# EAGLE design chirp-ble (EAGLE 6.6.0)
Plant watering alarm v2.4

## Sheet 1 of 2: Plant watering alarm v2.4
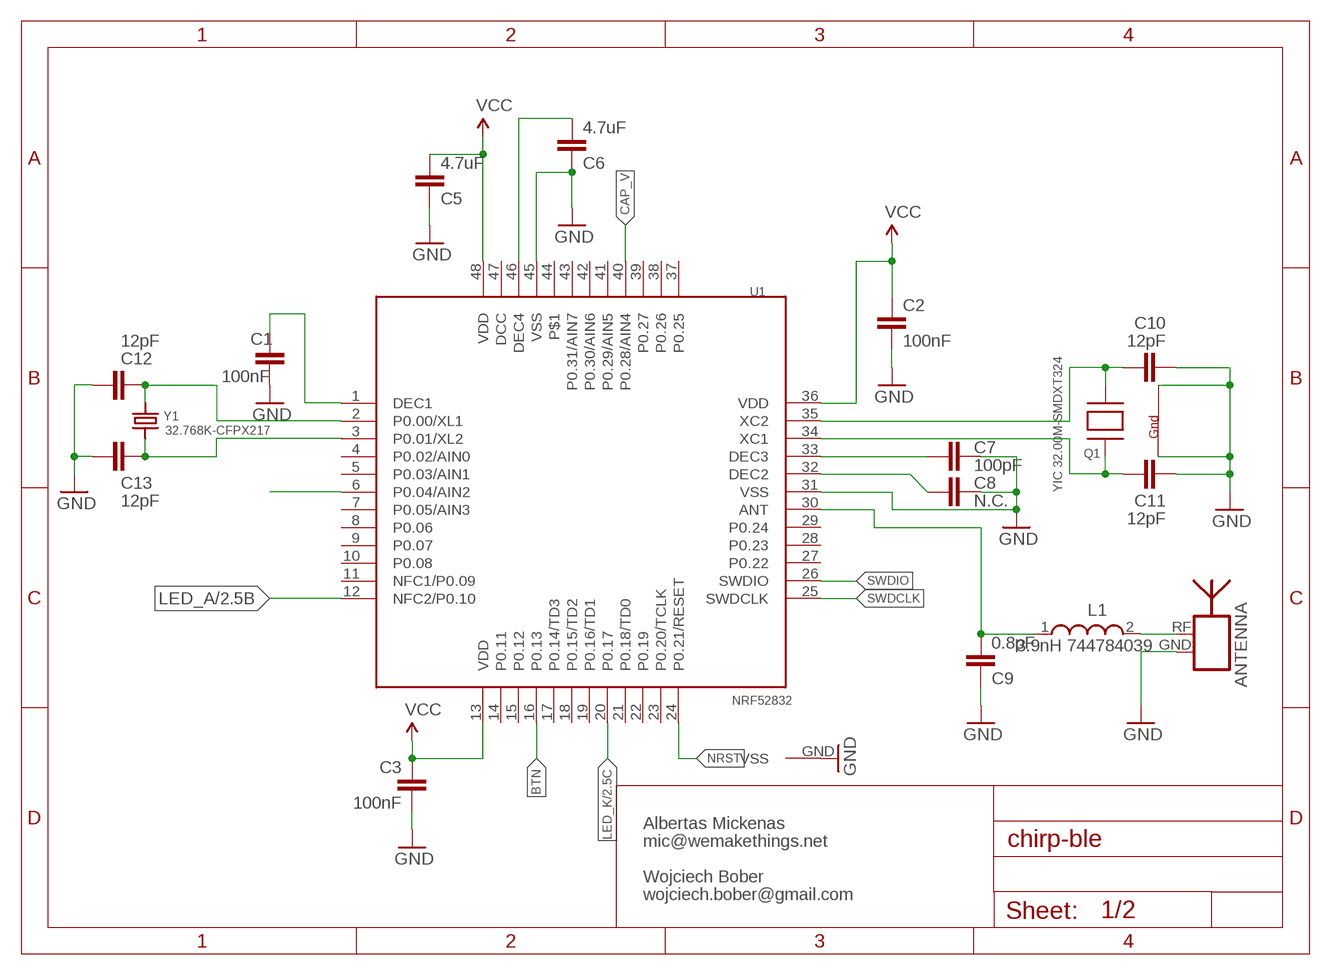
[diagram p0: schematic, sheet 1]

### Parts
ANTENNA  ANTENNA_1RIGHT  [SWRA117D_RIGHT]
C1  100nF  C-EUC0402  [C0402]
C2  100nF  C-EUC0402  [C0402]
C3  100nF  C-EUC0402  [C0402]
C5  4.7uF  C-EUC0402  [C0402]
C6  4.7uF  C-EUC0402  [C0402]
C7  100pF  C-EUC0402  [C0402]
C8  N.C.  C-EUC0402  [C0402]
C9  0.8pF  C-EUC0402  [C0402]
C10  12pF  C-EUC0402  [C0402]
C11  12pF  C-EUC0402  [C0402]
C12  12pF  C-EUC0402  [C0402]
C13  12pF  C-EUC0402  [C0402]
L1  3.9nH 744784039  WE-MK_0402  [WE-MK_0402]
Q1  YIC 32.00M-SMDXT324  XTAL-4-3225  [NX3225]
U1  NRF52832  [QFN48]
Y1  32.768K-CFPX217  CRYSTAL.ABS07  [ABS07]

### Nets
ANT: C9.2 L1.1 U1.30(ANT)
BTN: U1.16(P0.13) ; also sheet 2
CAP_V: U1.40(P0.28/AIN4) ; also sheet 2
CLK_OUT: U1.6(P0.04/AIN2) ; also sheet 2
GND: ANTENNA.GND C1.2 C2.2 C3.2 C5.1 C6.1 C7.2 C8.2 C9.1 C10.2 C11.2 C12.2 C13.1 Q1.2(G2) Q1.4(G1) U1.31(VSS) U1.45(VSS) U1.GND(VSS) ; also sheet 2
LED_A: U1.12(NFC2/P0.10) ; also sheet 2
LED_K: U1.20(P0.17) ; also sheet 2
N$1: C8.1 U1.32(DEC2)
N$2: C10.1 Q1.3(X2) U1.35(XC2)
N$4: ANTENNA.RF L1.2
N$7: C11.1 Q1.1(X1) U1.34(XC1)
N$10: C1.1 U1.1(DEC1)
N$11: C6.2 U1.46(DEC4)
N$12: C7.1 U1.33(DEC3)
NRST: U1.24(P0.21/RESET) ; also sheet 2
SWDCLK: U1.25(SWDCLK) ; also sheet 2
SWDIO: U1.26(SWDIO) ; also sheet 2
VCC: C2.1 C3.1 C5.2 U1.13(VDD) U1.36(VDD) U1.48(VDD) ; also sheet 2
Y1_M: C13.2 U1.3(P0.01/XL2) Y1.1
Y1_P: C12.1 U1.2(P0.00/XL1) Y1.2
Unconnected: U1.4(P0.02/AIN0) U1.5(P0.03/AIN1) U1.7(P0.05/AIN3) U1.8(P0.06) U1.9(P0.07) U1.10(P0.08) U1.11(NFC1/P0.09) U1.14(P0.11) U1.15(P0.12) U1.17(P0.14/TD3) U1.18(P0.15/TD2) U1.19(P0.16/TD1) U1.21(P0.18/TD0) U1.22(P0.19) U1.23(P0.20/TCLK) U1.27(P0.22) U1.28(P0.23) U1.29(P0.24) U1.37(P0.25) U1.38(P0.26) U1.39(P0.27) U1.41(P0.29/AIN5) U1.42(P0.30/AIN6) U1.43(P0.31/AIN7)

### Notes on the sheet
- Albertas Mickenas
- mic@wemakethings.net
- Wojciech Bober
- wojciech.bober@gmail.com

## Sheet 2 of 2
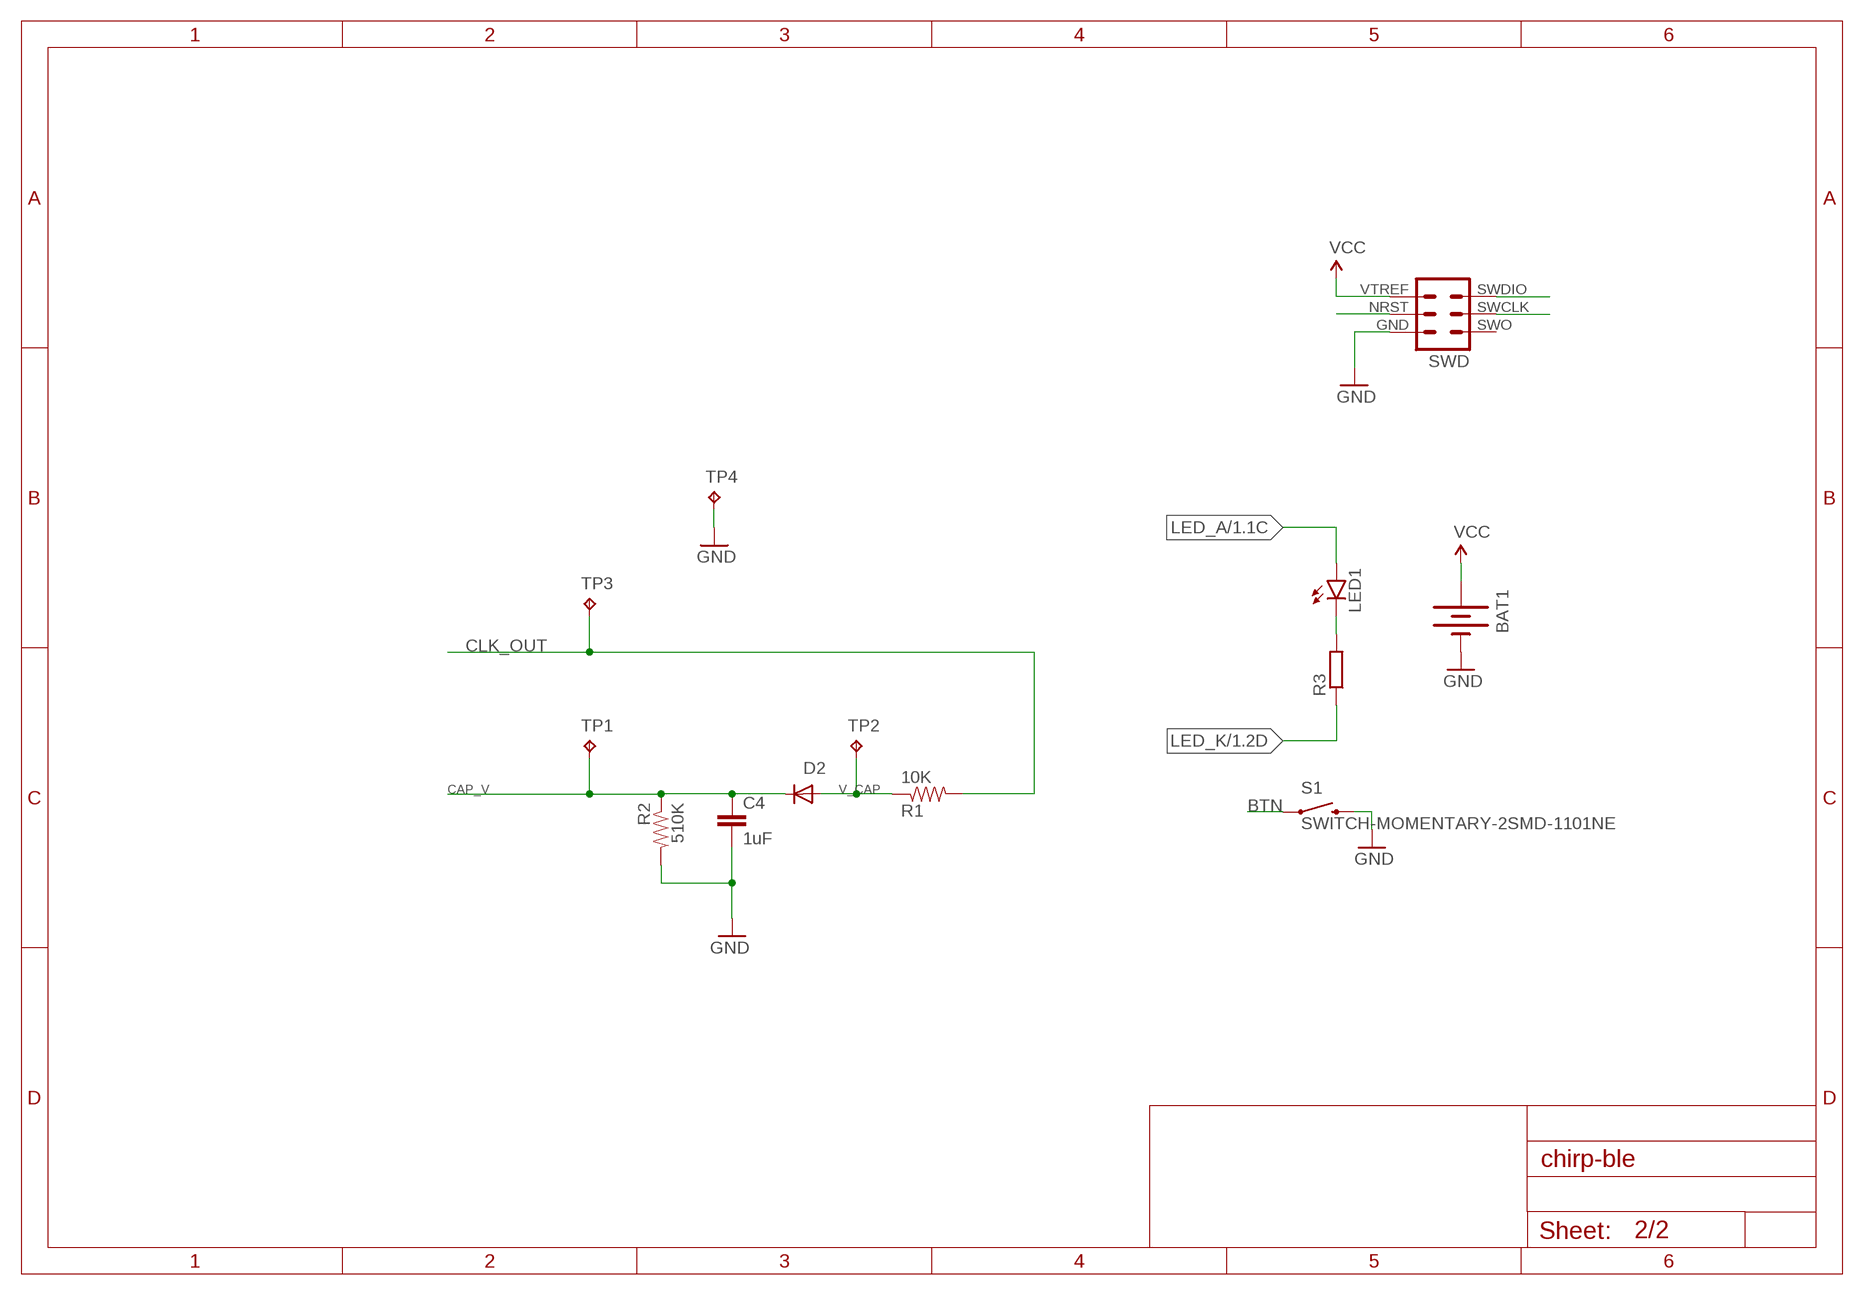
[diagram p1: schematic, sheet 2]

### Parts
BAT1  BATTERY12MM  [BATTCON_12MM]
C4  1uF  CAP0603-CAP  [0603-CAP]
D2  DIODE-SCHOTTKY_  DIODESOD-523  [SOD-523]
LED1  LED0603  [LED-0603]
R1  10K  RESISTOR0603-RES  [0603-RES]
R2  510K  RESISTOR0603-RES  [0603-RES]
R3  R-EU_R0402  [R0402]
S1  SWITCH-MOMENTARY-2SMD-1101NE  [TACTILE-SWITCH-1101NE]
SWD  SWD  [MA03-2]
TP1  TPB1,27  [B1,27]
TP2  TPB1,27  [B1,27]
TP3  TPB1,27  [B1,27]
TP4  TPB1,27  [B1,27]

### Nets
BTN: S1.1 ; also sheet 1
CAP_V: C4.1 D2.K(C) R2.1 TP1.TP ; also sheet 1
CLK_OUT: R1.2 TP3.TP ; also sheet 1
GND: BAT1.GND(-) C4.2 R2.2 S1.2 SWD.GND TP4.TP ; also sheet 1
LED_A: LED1.A ; also sheet 1
LED_K: R3.1 ; also sheet 1
N$6: LED1.C R3.2
NRST: SWD.NRST(NRESET) ; also sheet 1
SWDCLK: SWD.SWCLK ; also sheet 1
SWDIO: SWD.SWDIO ; also sheet 1
V_CAP: D2.A R1.1 TP2.TP
VCC: BAT1.PWR@1(+) BAT1.PWR@2(+) SWD.VTREF ; also sheet 1
Unconnected: SWD.SWO

## Power pins joined to a net without a drawn wire
DCC: U1.47(DCC)
P$1: U1.44

## Library data of the parts
ANTENNA = ant-planar-1:ANTENNA_1
BAT1 = SparkFun-Electromechanical:BATTERY: Battery Holders Various common sizes : AA, AAA, 18650 (PRT-12895), 20mm coin cell and 12mm coin cell. 20MM_4LEGS, BATT-10373; PROD_ID: BATT-08044
C1-C3 C5-C13 = rcl:C-EU: CAPACITOR, European symbol
C4 = SparkFun:CAP: Capacitor Standard 0603 ceramic capacitor, and 0.1" leaded capacitor.
D2 = microbuilder:DIODE: Diode SMADIODE - SMA Surface Mount Package 20V 1A Schottky Diode Digikey (500mV @ 1A, 500uA Vr @ 20V): 641-1014-6-ND 10V 2A Schottky Diode Digikey (350mV @ 2A, 700uA Vr @ 10V): MBRA210LT3 SOD-123 30V 200mA (800mV Vf, 2uA Vr @ 25V) Schottky Diode (very fast switching for boost, etc.) - Digikey: BAT54T1GOSTR-ND 30V 500mA (430mV Vf, 130uA Vr @ 30V) Schottky Diode - Digikey: B0530W-FDICT-ND MBR120 1A 20V (0.34Vf) Schottky Diode - Digikey: MBR120VLSFT1GOSCT-ND SOD-323 10V 570mA (380mV Vf, 3ns) Schottky Diode - Digikey: ZLLS410CT-ND 1N4148WS - 75V 150mA (1V Vf @ 10mA, 4ns) Simple Diode - Digikey: 1N4148WSFSCT-ND, Mouser: 512-1N4148WS SOD-523 BAT54 30V 200mA Schottky (0.8 Vf @ 100mA, 5ns) - Digikey: BAT54XV2CT-ND 30V 30mA Schottky Diode (RB751S-40TE61) - Digikey: RB751S-40TE61CT-ND SOT23-R/W - SOT23 Package (R = Solder Paste/Reflow Ovens, W = Hand-Soldering) BAT54Film 40V 300mA - Digikey: 497-7162-1-ND DO-1N4148 Through Hole Small Current Diode (any model)
L1 = SignalCommunications:WE-MK: Multilayer Ceramic SMD Inductor Characteristics Windings printed on ceramic substrate Extremely high self resonant frequency > 17 GHz Inductive tolerances of 5%; ± 0.3 nH Operating temperature: –40°C to +120°C Inductance is stable over temperature Applications High frequency circuits Bluetooth Wireless LAN Filter circuits Oscillators Pagers Laptops PCMCIA-cards <http://katalog.we-online.de/media/images/eisos/RfMK_pf2.jpg> Details see: http://katalog.we-online.de/en/pbs/WE-MK? Updated by Dan Xu 2014-07-08 2014 (C) Wurth Elektronik
LED1 = SparkFun-LED:LED: LEDs Standard schematic elements and footprints for 5mm, 3mm, 1206, and 0603 sized LEDs. 5mm - Spark Fun Electronics SKU : COM-00529 (and others)
Q1 = adafruit:XTAL-4: Classic 4-pin 3.2 x 2.5mm crystal
R1 R2 = SparkFun:RESISTOR: Resistor Basic schematic elements and footprints for 0603, 1206, and PTH resistors.
R3 = rcl:R-EU_: RESISTOR, European symbol
S1 = SparkFun-Electromechanical:SWITCH-MOMENTARY-2: Various NO switches- pushbuttons, reed, etc; PROD_ID: SWCH-00815
SWD = WB:SWD: PIN HEADER; OC_FARNELL: unknown; OC_NEWARK: unknown
TP1-TP4 = testpad:TP: Test pad
U1 = NordicSemi:NRF52832: Bluetooth 4.0 Low Energy/2.4Ghz NORDIC SEMICONDUCTOR
Y1 = abracon:CRYSTAL

## Net classes
0 Default: width 0.2 mm

## Board
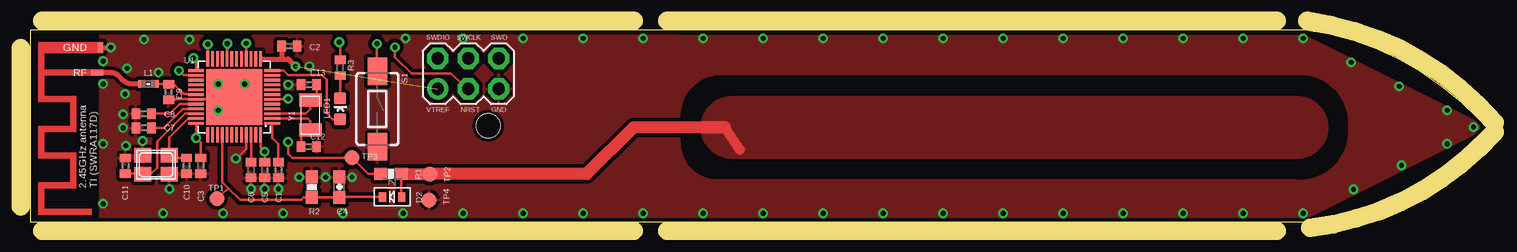
[diagram p2: board, top side]
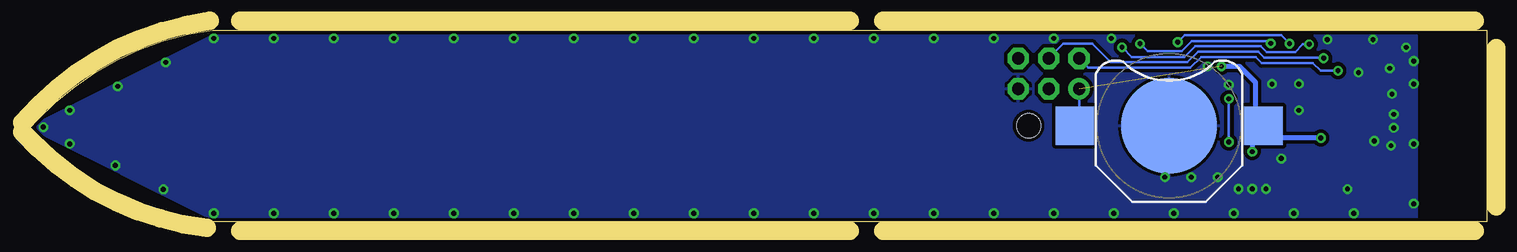
[diagram p3: board, bottom side, seen from below]

Size 121.41 x 16 mm. Coordinates in mm from the lower left corner, seen from the top.
Outline: 0,0 106.17,0 arc39 120.78,7.24 121.41,7.87 120.78,8.51 arc39 106.17,16 0,16 0,0
Copper layers (1*16): Top 0.035mm / dielectric 1mm / Bottom 0.035mm
Design rules "Fusion_eagle_rule_v1.1 *": minimum track width 0.2mm, minimum drill 0.4mm, track to track 0.2mm, track to pad 0.2mm, pad to pad 0.05mm, via to via 0.2mm, smd to smd 0mil, copper to edge 10mil, drill to drill 10mil, minimum pad ring 10mil, minimum via ring 6mil, stop-mask expansion 2mil, vias tented up to drill 0.3mm, thermal gap 10mil
Holes 2 mm at 38.19,8
tRestrict: area 9.5,9.5 to 10.9,10.9
Milling: 8 lines

### Footprints (pad centres in the part's own frame; a part is rotated, then mirrored left to right if it is on the bottom)
SWRA117D_RIGHT = smd 0.813 x 0.406: GND -0.45,0.25 | smd 0.508 x 1.016: RF -2.55,0.5
BATTCON_12MM = smd 8 x 8: GND 0,0 | smd 3.175 x 3.175: PWR@1 -7.874,0; PWR@2 7.874,0
C0402 = smd 0.7 x 0.9: 1 -0.65,0; 2 0.65,0
0603-CAP = smd 1.1 x 1: 1 -0.85,0; 2 0.85,0
SOD-523 = smd 0.8 x 0.6: A 0,-0.8; K 0,0.8
WE-MK_0402 = smd 0.6 x 0.6: 1 -0.55,0; 2 0.55,0
LED-0603 = smd 1 x 1: A 0,-0.877; C 0,0.877
NX3225 = smd 1.4 x 1.2: 1 -1.1,-0.8; 2 1.1,-0.8; 3 1.1,0.8; 4 -1.1,0.8
0603-RES = smd 1.1 x 1: 1 -0.85,0; 2 0.85,0
R0402 = smd 0.7 x 0.9: 1 -0.65,0; 2 0.65,0
TACTILE-SWITCH-1101NE = smd 2.3 x 1.6: 1 -3.15,0; 2 3.15,0
MA03-2 = drill 1.016 pad 1.778 octagon: GND 2.54,-1.27; NRST 0,-1.27; SWCLK 0,1.27; SWDIO -2.54,1.27; SWO 2.54,1.27 | drill 1.016 pad 1.778: VTREF -2.54,-1.27
B1,27 = smd 1.27 x 1.27: TP 0,0
QFN48 = smd 1.3 x 0.226: 1 -3.17,2.2; 2 -3.17,1.8; 3 -3.17,1.4; 4 -3.17,1; 5 -3.17,0.6; 6 -3.17,0.2; 7 -3.17,-0.2; 8 -3.17,-0.6; 9 -3.17,-1; 10 -3.17,-1.4; 11 -3.17,-1.8; 12 -3.17,-2.2; 25 3.17,-2.2; 26 3.17,-1.8; 27 3.17,-1.4; 28 3.17,-1; 29 3.17,-0.6; 30 3.17,-0.2; 31 3.17,0.2; 32 3.17,0.6; 33 3.17,1; 34 3.17,1.4; 35 3.17,1.8; 36 3.17,2.2 | smd 0.226 x 1.3: 13 -2.2,-3.17; 14 -1.8,-3.17; 15 -1.4,-3.17; 16 -1,-3.17; 17 -0.6,-3.17; 18 -0.2,-3.17; 19 0.2,-3.17; 20 0.6,-3.17; 21 1,-3.17; 22 1.4,-3.17; 23 1.8,-3.17; 24 2.2,-3.17; 37 2.2,3.17; 38 1.8,3.17; 39 1.4,3.17; 40 1,3.17; 41 0.6,3.17; 42 0.2,3.17; 43 -0.2,3.17; 44 -0.6,3.17; 45 -1,3.17; 46 -1.4,3.17; 47 -1.8,3.17; 48 -2.2,3.17 | smd 4.66 x 4.66: GND 0,0
ABS07 = smd 1.1 x 1.9: 1 -1.25,0; 2 1.25,0

### Placement (x,y rotation side)
ANTENNA  6.1,14.99 90 top
BAT1  26.49,8 0 bottom
C1  20.7,4.32 270 top
C2  21.62,14.65 0 top
C3  14.22,4.66 270 top
C4  25.78,2.88 90 top
C5  19.56,4.32 90 top
C6  18.41,4.32 90 top
C7  9.47,7.83 180 top
C8  9.47,9.01 180 top
C9  11.55,10.83 90 top
C10  13.05,4.66 270 top
C11  7.95,4.66 90 top
C12  23.24,6.26 0 top
C13  23.24,11.43 0 top
D2  30.18,2.06 90 top
L1  9.87,11.5 180 top
LED1  25.85,9.41 0 top
Q1  10.51,4.75 0 top
R1  30.08,3.98 180 top
R2  23.5,2.88 90 top
R3  25.84,12.84 270 top
S1  28.96,9.4 270 top
SWD  36.52,12.35 0 top
TP1  15.58,1.93 0 top
TP2  33.31,3.96 0 top
TP3  26.84,5.32 0 top
TP4  33.26,1.8 0 top
U1  17.02,10.41 180 top
Y1  23.37,8.89 270 top

### Tracks (layer width: path | path; a pad name or v marks a point on that pad's centre or on a via)
ANT
  Top 0.2: U1.30 13.22,10.61 arc-45 12.51,10.91 12.16,11.31 arc45 11.75,11.45 11.58,11.45 C9.2 10.44,11.48 L1.1
BTN  (via drill 0.4 pad 0.8)
  Top 0.2: v28.91,14.85 28.91,12.59 S1.1
  Top 0.203: U1.16 v18.02,14.87
  Bottom 0.2: 27.38,14.22 28.28,14.22 v28.91,14.85
  Bottom 0.203: 18.02,14.75 v18.02,14.87 18.24,15.06 24.6,15.06 25.44,14.22 27.38,14.22
CAP_V
  Top 0.203: U1.40 16.02,3.29 16.51,2.79 | 16.51,2.79 17.5,1.8 22.59,1.8 22.82,2.03 R2.1 | TP1.TP 15.51,1.86 16.51,2.79 | R2.1 | R2.1 C4.1 25.81,2.06 D2.K
CLK_OUT  (via drill 0.4 pad 0.8)
  Top 0.2: TP3.TP 21.84,5.32 21.51,5.65 v21.51,6.65 | TP3.TP | R1.2 28.19,3.98 TP3.TP
  Top 0.203: U1.6 21.51,10.21 v21.51,10.25
  Bottom 0.203: v21.51,10.25 v21.51,6.65
GND  (via drill 0.4 pad 0.8)
  Top 0.2: U1.31 13.84,10.2 | C9.1 11.79,10.21 U1.31 | v15.68,9.29 14.75,10.21 U1.31 | U1.GND 17.02,10.61 v17.91,11.49
  Top 0.203: U1.31 | U1.45 18.02,6.08 17.27,5.33 17.27,5.08
  Top 0.406: ANTENNA.GND v6.73,14.54
  other vias: 15.68,11.49 18.41,2.73 19.56,2.73 20.7,2.73 24.64,3.71 11.62,2.72 9.39,6.74 7.76,8.97 7.76,7.83 22.43,3.71 21.52,11.43 17.14,5.27 6.1,13.4 6.1,11.49 6.1,6.49 6.1,1.49 23.28,12.97 8.1,12.8 7.91,10.65 10.71,12.45 7.99,6.34 26.84,3.71 9.5,15.2 13.3,15.2 11.1,0.69 16.1,0.69 21.1,0.69 26.1,0.69 31.1,0.69 36.1,0.69 41.1,0.69 46.1,0.69 51.1,0.69 56.1,0.69 61.1,0.69 66.1,0.69 71.1,0.69 76.1,0.69 81.1,0.69 86.1,0.69 91.1,0.69 101.1,0.69 106.1,0.69 96.1,0.69 46.1,15.29 51.1,15.29 56.1,15.29 61.1,15.29 66.1,15.29 71.1,15.29 76.1,15.29 81.1,15.29 86.1,15.29 91.1,15.29 96.1,15.29 101.1,15.29 106.1,15.29 36.1,15.29 41.1,15.29 31.3,15.29 110.1,13.29 114.1,11.29 118.1,9.29 120.3,7.89 110.3,2.69 114.3,4.69 118.1,6.49
  pour Top (isolate 0.305): 5.84,15.48 5.84,0.25 54.1,0.25 54.1,15.48
  pour Bottom (isolate 0.305): 5.84,15.48 106.24,15.48 121.41,7.87 106.17,0.25 5.84,0.25
  pour Top (isolate 0.305, no thermals): 54.1,15.48 106.24,15.48 121.41,7.87 106.17,0.25 54.1,0.25 54.1,6.6 arc90 57.28,3.43 105.54,3.43 arc90 109.98,7.24 109.98,8.51 arc90 105.54,12.32 57.91,12.32 arc90 54.1,9.14
LED_A
  Top 0.2: U1.12 21.15,12.61 21.51,12.25 24.31,12.25 24.71,11.85 24.71,9.05 25.23,8.54 LED1.A
LED_K  (via drill 0.4 pad 0.8)
  Top 0.2: R3.1 25.84,14.91 v25.77,14.99
  Top 0.203: U1.20 16.42,14.83 v16.45,14.86
  Bottom 0.203: 16.45,14.79 v16.45,14.86 17.12,15.58 25.17,15.58 v25.77,14.99
N$1
  Top 0.2: U1.32 12.47,9.81 11.66,9.01 C8.1
N$2
  Top 0.203: U1.35 13.19,8.61 11.61,7.03 Q1.3 11.84,5.31 C10.1
N$4
  Top 0.4: L1.2 8.48,11.5 arc-45 7.78,11.79 7.42,12.14 arc45 6.72,12.44 ANTENNA.RF
  Top 0.406: ANTENNA.RF arc-45 5.62,12.45
N$6
  Top 0.2: LED1.C R3.2
N$7
  Top 0.203: U1.34 12.93,9.01 10.59,6.68 10.59,4.49 10.16,4.06 9.52,4.06 Q1.1 9.34,4.01 C11.1
N$10
  Top 0.203: C1.1 20.7,6.48 20.19,6.99 U1.1
N$11
  Top 0.203: C6.2 U1.46
N$12
  Top 0.2: 12.13,8.83 11.13,7.83 C7.1
  Top 0.203: U1.33 12.72,9.41 12.13,8.83
NRST  (via drill 0.4 pad 0.8)
  Top 0.2: SWD.NRST 35.05,12.35 31.81,12.35 30.41,13.75 v30.41,14.55
  Top 0.203: U1.24 v14.82,14.8 v14.81,14.8
  Bottom 0.2: 29.61,13.75 v30.41,14.55
  Bottom 0.203: v14.81,14.8 15.36,14.8 15.96,14.15 18.36,14.15 18.86,14.65 24.31,14.65 25.21,13.75 29.61,13.75
SWDCLK  (via drill 0.4 pad 0.8)
  Top 0.203: U1.25 13.86,12.63 13.86,13.4 v13.61,13.65
  Bottom 0.2: 24.96,13.3 31.36,13.3 32.91,14.85 35.29,14.85 SWD.SWCLK
  Bottom 0.203: v13.61,13.65 13.66,13.7 18.56,13.7 19.06,14.2 24.06,14.2 24.96,13.3
SWDIO  (via drill 0.4 pad 0.8)
  Top 0.2: U1.26 12.8,12.21 v12.41,12.6
  Bottom 0.2: v12.41,12.6 13.86,12.6 14.51,13.25 18.76,13.25 19.26,13.75 23.81,13.75 24.71,12.85 33.21,12.85 SWD.SWDIO
V_CAP
  Top 0.203: D2.A 30.93,2.11 R1.1
  Top 0.813: 57.91,7.87 59.16,5.99
  Top 1.016: 57.91,7.87 50.29,7.87 46.4,3.98 33.33,3.98 TP2.TP 33.29,3.98 R1.1
  pour Top (no thermals): 56.01,7.87 arc-90 58.55,10.41 105.54,10.41 arc-90 108.08,7.87 arc-90 105.54,5.33 58.55,5.33 arc-90
VCC  (via drill 0.4 pad 0.8)  (1 unrouted)
  Top 0.2: 20.97,13.64 20.91,13.58
  Top 0.203: C3.1 14.22,6.6 v13.85,6.98 | v13.85,6.98 U1.36 | C5.2 v19.56,5.84 19.22,6.18 U1.48 | U1.13 19.33,13.58 | v13.85,6.98 v13.84,6.98
  Top 0.4: 19.33,13.58 20.91,13.58 21.51,13.58 v22.12,12.97 | C2.1 20.97,13.64
  Bottom 0.2: 17.91,8.5 BAT1.PWR@2
  Bottom 0.203: BAT1.PWR@2 19.3,9.65 | BAT1.PWR@1 arc-90 33.98,8.78 SWD.VTREF
  Bottom 0.4: v22.12,12.97 20.63,12.97 19.3,11.65 19.3,9.65 | v13.84,6.98 18.63,6.98 | 18.63,6.98 BAT1.PWR@2 | 18.63,6.98 19.56,6.98 v19.56,5.84
Y1_M
  Top 0.2: 23.37,9.4 22.98,9.01 U1.3
  Top 0.203: 23.37,9.4 Y1.1 23.89,10.66 C13.2
Y1_P
  Top 0.2: 23.39,7.62 23.79,7.22 | Y1.2 22.59,7.64 C12.1
  Top 0.203: U1.2 23.14,8.61 23.37,8.38 Y1.2 23.39,7.62

### Text on the board
_tsilk: CERN OHL | put this part to soil | v.1.1